# EAGLE design DisplayAddOn_V03-002 (EAGLE 9.3.0)
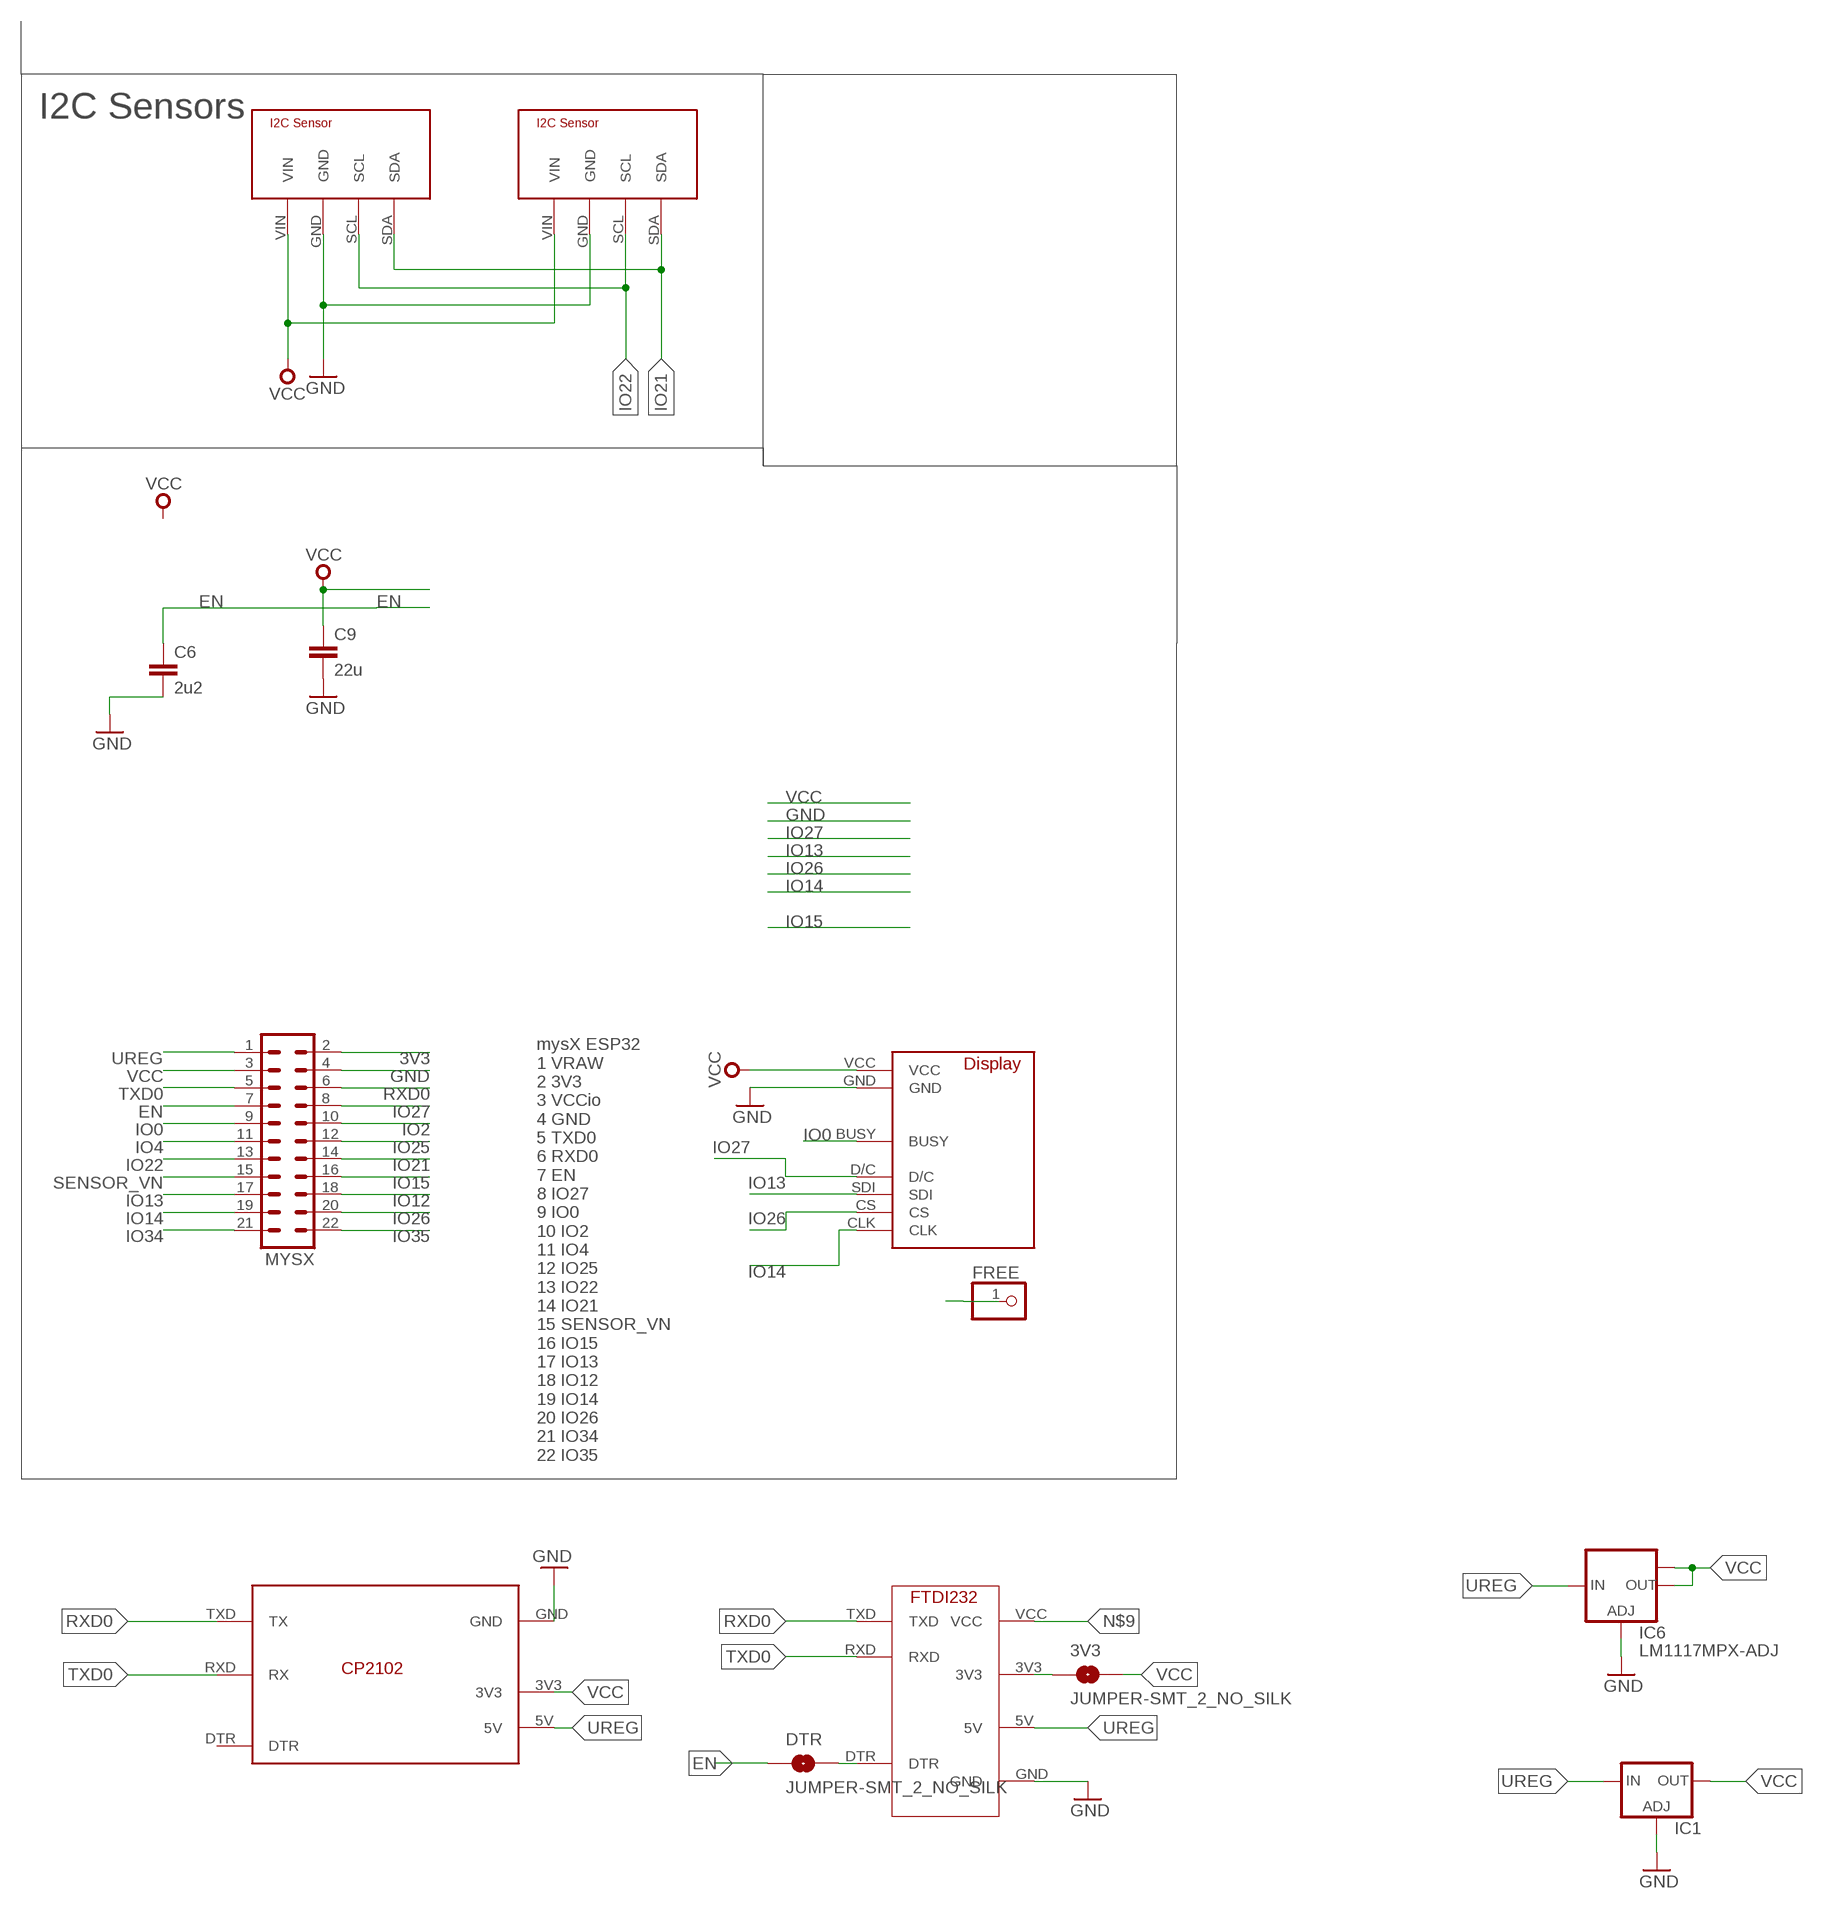
[diagram p0: schematic, sheet 1]

## Parts
3V3  JUMPER-SMT_2_NO_SILK  [SMT-JUMPER_2_NO_SILK]
C6  2u2  C-EUC0805  [C0805]
C9  22u  C-EUC0805  [C0805]
DTR  JUMPER-SMT_2_NO_SILK  [SMT-JUMPER_2_NO_SILK]
FREE  PINHD-1X1  [1X01]
HELTEK  ZUCZUG_1.54  [ZUCZUG_1.54INCH]
IC1  LD117ADT50TR  [DPACK]
IC6  LM1117MPX-ADJ  [SOT223]
MYSX  MA11-2  [MA11-2]
U$1  CP2101  [CP2101-BEAKOUT]
U$2  I2C-BREAKOUT  [I2C_BREAKOUT]
U$3  FTDI232  [FTDI232-LARGE-LESS-PINS]
U$4  I2C-BREAKOUT  [I2C_BREAKOUT]

## Nets
3V3: MYSX.2
EN: C6.1 DTR.1 MYSX.7
FREE: FREE.1
GND [gnd]: C6.2 C9.2 HELTEK.GND IC1.1(ADJ) IC6.1(ADJ) MYSX.4 U$1.GND U$2.GND U$3.GND U$4.GND
IO0: HELTEK.BUSY MYSX.9
IO2: MYSX.10
IO4: MYSX.11
IO12: MYSX.18
IO13: HELTEK.SDI MYSX.17
IO14: HELTEK.CLK MYSX.19
IO15: MYSX.16
IO21: MYSX.14 U$2.SDA U$4.SDA
IO22: MYSX.13 U$2.SCL U$4.SCL
IO25: MYSX.12
IO26: HELTEK.CS MYSX.20
IO27: HELTEK.D/C MYSX.8
IO34: MYSX.21
IO35: MYSX.22
N$1: DTR.2 U$3.DTR
N$2: 3V3.1 U$3.3V3
N$9: U$3.VCC
RXD0: MYSX.6 U$1.TXD(TX) U$3.TXD
SENSOR_VN: MYSX.15
TXD0: MYSX.5 U$1.RXD(RX) U$3.RXD
UREG [gnd]: IC1.3(IN) IC6.3(IN) MYSX.1 U$1.5V U$3.5V
VCC [gnd]: 3V3.2 C9.1 HELTEK.VCC IC1.4(OUT) IC6.2(OUT) IC6.TAB(OUT1) MYSX.3 U$1.3V3 U$2.VIN U$4.VIN
Unconnected: U$1.DTR

## Notes on the sheet
- I2C Sensors
- mysX ESP32
  1 VRAW
  2 3V3
  3 VCCio
  4 GND
  5 TXD0
  6 RXD0
  7 EN
  8 IO27
  9 IO0
  10 IO2
  11 IO4
  12 IO25
  13 IO22
  14 IO21
  15 SENSOR_VN
  16 IO15
  17 IO13
  18 IO12
  19 IO14
  20 IO26
  21 IO34
  22 IO35

## Library data of the parts
3V3 DTR = SparkFun-Jumpers:JUMPER-SMT_2_NO: Normally open jumper This jumper has two pads in close proximity to each other. Apply solder to close the connection. Round pads are easier to solder for beginners, but are a lot larger. SparkFun Product that uses the round pads: SparkFun EL Sequencer <https://www.sparkfun.com/products/12781>
C6 C9 = rcl@1:C-EU: CAPACITOR, European symbol; SPICEPREFIX: C
FREE = pinhead:PINHD-1X1: PIN HEADER
HELTEK = display_v2:ZUCZUG_1.54
IC1 = v-reg:LD117A?*: Low drop fixed and adjustable positive voltage regulators 1 A Source: http://www.st.com/stonline/products/literature/ds/7194/ld1117axx.pdf
IC6 = lm1117:LM1117MPX-ADJ
MYSX = con-Pinheader:MA11-2: PIN HEADER; OC_FARNELL: unknown; OC_NEWARK: unknown
U$1 = Martin-USB-V002:CP2101
U$2 U$4 = i2c:I2C-BREAKOUT
U$3 = Martin-USB-V002:FTDI232

## Net classes
0 default: width 0.356 mm, clearance 0.254 mm
1 gnd: width 0.457 mm, clearance 0.254 mm
2 vcc: width 0.457 mm, clearance 0.254 mm

## Board
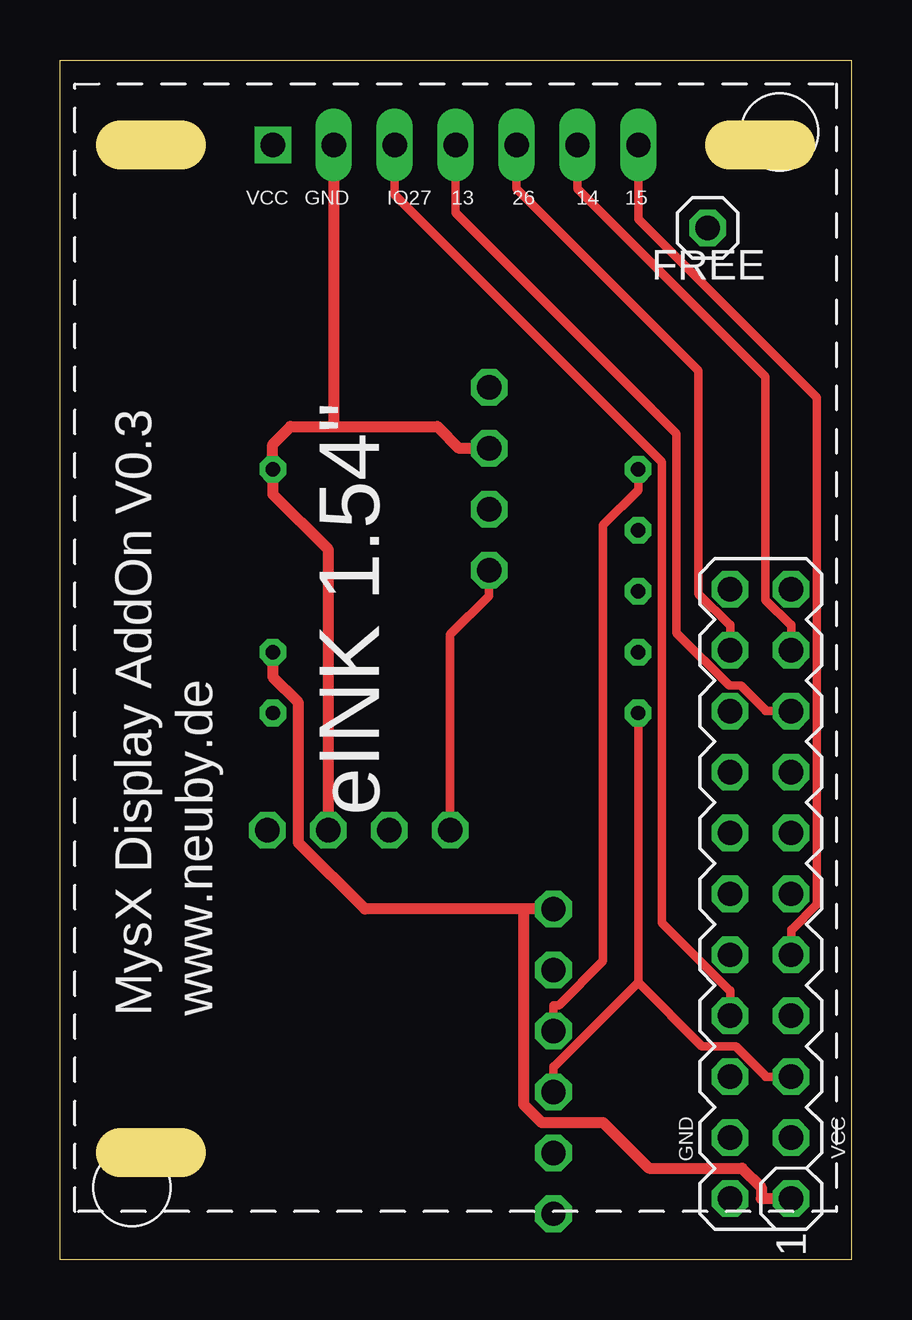
[diagram p1: board, top side]
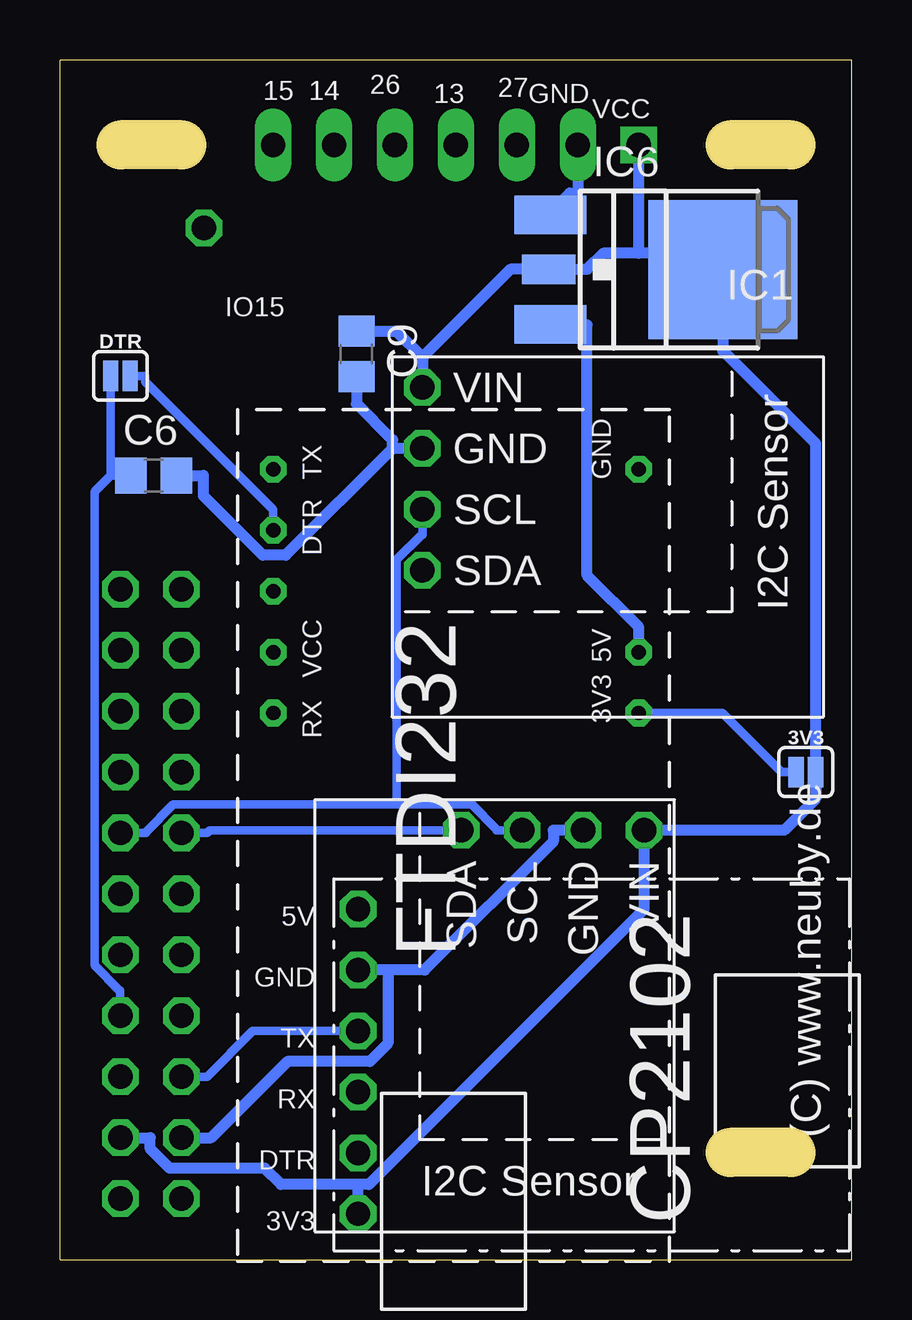
[diagram p2: board, bottom side, seen from below]

Size 33 x 50 mm. Coordinates in mm from the lower left corner, seen from the top.
Outline: 0,0 0,50 33,50 33,0 0,0
Copper layers (1*16): Top 0.035mm / dielectric 1.5mm / Bottom 0.035mm
Design rules "dirt_cheap_dirty_boards.v1": minimum track width 5mil, minimum drill 12mil, track to track 5mil, track to pad 5mil, pad to pad 5mil, via to via 5mil, smd to smd 0mil, copper to edge 10mil, drill to drill 10mil, minimum pad ring 10mil, minimum via ring 6mil, stop-mask expansion 2mil, vias tented up to drill 25mil, thermal gap 10mil
tRestrict: area 32,0 to 33,50; area 0,49 to 32,50
bRestrict: area 32,0 to 33,50; area 0,49 to 32,50

### Footprints (pad centres in the part's own frame; a part is rotated, then mirrored left to right if it is on the bottom)
SMT-JUMPER_2_NO_SILK = smd 0.635 x 1.27: 1 -0.406,0; 2 0.406,0
C0805 = smd 1.3 x 1.5: 1 -0.95,0; 2 0.95,0
1X01 = drill 1.016 octagon: 1 0,0
ZUCZUG_1.54INCH = drill 1.016 long: BUSY 21.59,-9.525; CLK 21.59,-6.985; CS 21.59,-4.445; D/C 21.59,0.635; GND 21.59,3.175; SDI 21.59,-1.905 | drill 1.016 square: VCC 21.59,5.715
DPACK = smd 1.6 x 3: 1 -2.28,-4.8; 3 2.28,-4.8 | smd 5.8 x 6.2: 4 0,2.38
SOT223 = smd 1.219 x 2.235: 1 -2.311,-3.099; 2 0,-3.099; 3 2.311,-3.099 | smd 3.6 x 2.2: TAB 0,3.099
MA11-2 = drill 1.016 octagon: 1 -12.7,-1.27; 2 -12.7,1.27; 3 -10.16,-1.27; 4 -10.16,1.27; 5 -7.62,-1.27; 6 -7.62,1.27; 7 -5.08,-1.27; 8 -5.08,1.27; 9 -2.54,-1.27; 10 -2.54,1.27; 11 0,-1.27; 12 0,1.27; 13 2.54,-1.27; 14 2.54,1.27; 15 5.08,-1.27; 16 5.08,1.27; 17 7.62,-1.27; 18 7.62,1.27; 19 10.16,-1.27; 20 10.16,1.27; 21 12.7,-1.27; 22 12.7,1.27
CP2101-BEAKOUT = drill 1.016 octagon: 3V3 13.97,1.016; 5V 1.27,1.016; DTR 11.43,1.016; GND 3.81,1.016; RXD 8.89,1.016; TXD 6.35,1.016
I2C_BREAKOUT = drill 1.016 octagon: GND -3.81,-8.89; SCL -1.27,-8.89; SDA 1.27,-8.89; VIN -6.35,-8.89
FTDI232-LARGE-LESS-PINS = drill 0.6 octagon: 3V3 22.86,1.27; 5V 25.4,1.27; DTR 30.48,16.51; GND 33.02,1.27; RTS 27.94,16.51; RXD 22.86,16.51; TXD 33.02,16.51; VCC 25.4,16.51

### Placement (x,y rotation side)
3V3  1.91,20.32 0 bottom
C6  29.09,32.68 0 bottom
C9  20.64,37.75 270 bottom
DTR  30.48,36.83 0 bottom
FREE  27,43 0 top
HELTEK  14.59,24.87 90 top
IC1  7.75,41.27 270 bottom
IC6  9.53,41.27 270 bottom
MYSX  29.21,15.24 90 top
U$1  21.59,15.88 270 bottom
U$2  9,30 270 bottom
U$3  7.6,-0.08 90 bottom
U$4  15,9 180 bottom

### Tracks (layer width: path | path; a pad name or v marks a point on that pad's centre or on a via)
EN
  Bottom 0.356: MYSX.7 30.48,11.23 30.52,11.23 31.55,12.25 31.55,32.02 30.89,32.68 | C6.1 30.89,32.68 | DTR.1 30.89,32.68
GND
  Top 0.457: 11.41,34.72 15.74,34.72 16.64,33.81 U$2.GND | 11.41,34.72 9.61,34.72 8.87,33.98 U$3.GND 8.87,31.9 11.19,29.58 U$4.GND | HELTEK.GND 11.41,34.72
  Bottom 0.457: MYSX.4 26.7,5.08 23.52,8.26 20.08,8.26 19.32,9.01 19.32,12.06 | 19.32,12.06 U$1.GND | 19.32,12.06 17.79,12.06 12.44,17.42 12.44,17.89 U$4.GND | C6.2 27.01,32.68 27.01,31.83 24.54,29.36 23.58,29.36 19.14,33.81 | 19.14,33.81 18.96,33.81 U$2.GND | HELTEK.GND 11.41,44.45 11.74,44.45 12.61,43.59 | 12.61,43.59 12.59,43.59 IC1.1 | IC6.1 12.61,43.59 | 19.14,33.81 19.14,34.16 20.64,35.67 C9.2
IO0
  Top 0.356: MYSX.9 30.48,13.77 30.52,13.77 31.55,14.79 31.55,35.92 24.11,43.36 HELTEK.BUSY
IO13
  Top 0.356: HELTEK.SDI 16.5,43.64 25.7,34.43 25.7,26.12 27.9,23.93 28.39,23.93 29.41,22.9 29.41,22.86 MYSX.17
IO14
  Top 0.356: HELTEK.CLK 21.57,44.63 29.41,36.79 29.41,27.49 30.44,26.47 30.48,26.47 MYSX.19
IO21
  Top 0.356: U$4.SDA 16.27,26.04 17.89,27.66 U$2.SDA
  Bottom 0.356: MYSX.14 26.87,17.78 26.76,17.89 U$4.SDA
IO22
  Bottom 0.356: 18.96,18.96 28.27,18.96 29.41,17.82 29.41,17.78 MYSX.13 | 18.96,18.96 15.82,18.96 14.8,17.93 14.8,17.89 U$4.SCL | 18.96,18.96 18.96,29.17 17.93,30.2 17.89,30.2 U$2.SCL
IO26
  Top 0.356: HELTEK.CS 19.04,44.63 26.62,37.05 26.62,27.74 27.9,26.47 27.94,26.47 MYSX.20
IO27
  Top 0.356: MYSX.8 27.94,11.23 27.9,11.23 25.1,14.03 25.1,33.24 13.96,44.38 HELTEK.D/C
N$1
  Bottom 0.356: DTR.2 29.45,36.83 29.45,36.6 24.11,31.26 U$3.DTR
N$2
  Bottom 0.356: 3V3.1 2.93,20.32 5.39,22.78 U$3.3V3
RXD0
  Top 0.356: U$1.TXD 20.57,10.59 20.8,10.59 22.64,12.44 22.64,30.61 24.11,32.08 U$3.TXD
  Bottom 0.356: MYSX.6 26.87,7.62 24.97,9.53 U$1.TXD
TXD0
  Top 0.356: 24.11,11.55 20.61,8.05 20.57,8.05 U$1.RXD | U$3.RXD 24.11,11.55 | 24.11,11.55 26.77,8.89 28.18,8.89 29.41,7.66 29.41,7.62 MYSX.5
UREG
  Top 0.457: 19.33,14.61 12.71,14.61 9.95,17.37 9.95,23.21 8.87,24.28 U$3.5V | U$1.5V 19.33,14.61 | 19.33,14.61 19.33,6.47 20.08,5.71 22.64,5.71 24.54,3.81 28.43,3.81 29.23,3.01 29.23,2.54 MYSX.1
  Bottom 0.457: U$3.5V 8.87,26.36 11.02,28.51 11.02,38.96 IC6.3 12.57,38.96 IC1.3
VCC
  Bottom 0.457: MYSX.3 29.23,5.08 29.23,4.61 28.43,3.81 24.46,3.81 23.78,3.13 20.57,3.13 | 20.57,3.13 20.12,3.13 8.65,14.6 U$4.VIN 2.81,17.89 1.5,19.2 3V3.2 1.5,34.01 5.37,37.88 IC1.4 IC6.TAB 6.43,41.95 8.88,41.95 | U$1.3V3 20.57,3.13 | 8.88,41.95 10.35,41.95 11.02,41.27 IC6.2 14.22,41.27 17.89,37.61 | 8.88,41.95 HELTEK.VCC | 17.89,37.61 U$2.VIN | C9.1 18.98,38.7 17.89,37.61

### Text on the board
tNames: VCC | GND | IO27 | 13 | 26 | 14 | 15 | MysX Display AddOn V0.3 | www.neuby.de | GND | VCC
bNames: GND | 27 | 13 | 26 | 14 | 15 | VCC | IO15 | GND | TX | DTR | 5V | VCC | 3V3 | RX | 5V | GND | TX | RX | (C) www.neuby.de | DTR | 3V3
Document: DS_1551K
tDocu: Please produce the milling. / Thanks!